# EAGLE design MPB_v1 (EAGLE 6.6.0)
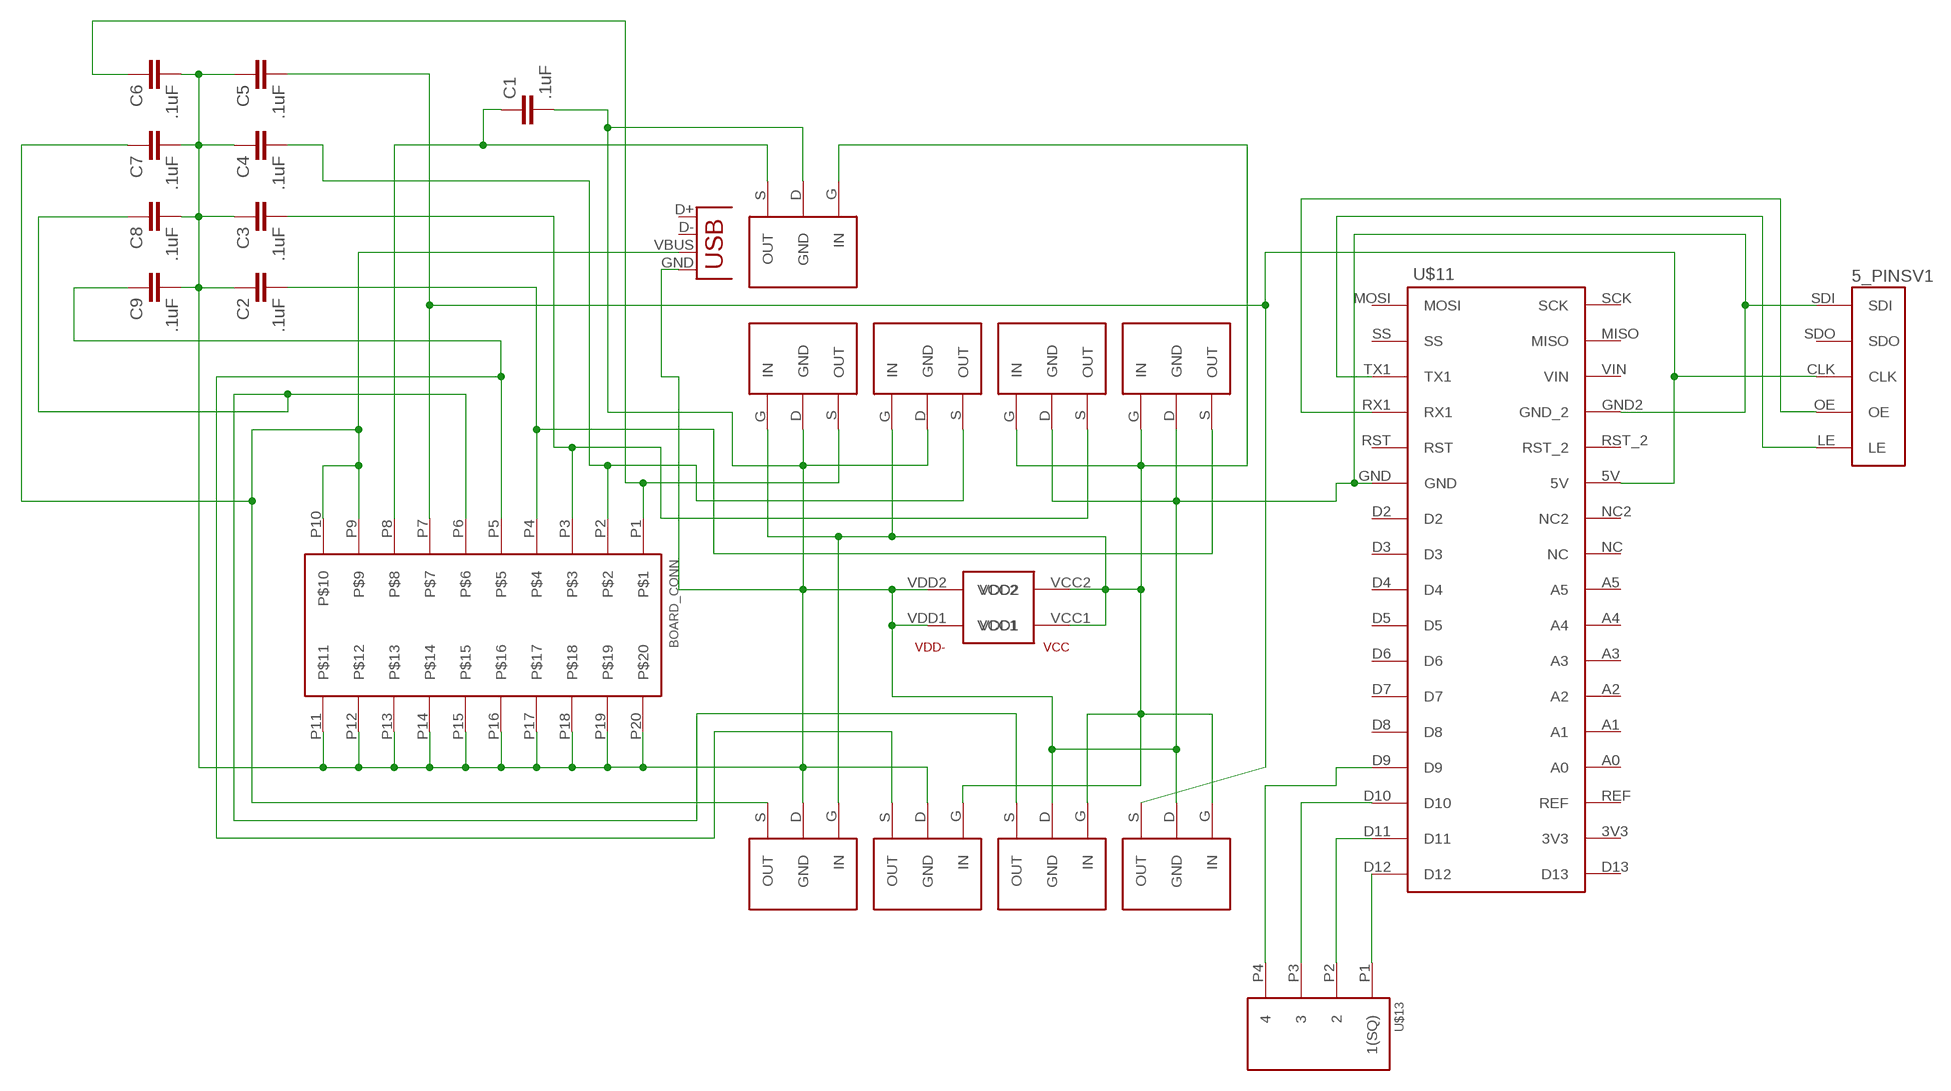
[diagram p0: schematic, sheet 1]

## Parts
_  USB-A-SMD  [USB-A-S-NOSILK-FEMALE]
BOARD_CONN  20PIN_HEADER  [20PIN_3MMHEADER]
C1  .1uF  0.1UF-50V-20%(PTH)KIT-EZ  [CAP-PTH-SMALL-KIT]
C2  .1uF  0.1UF-50V-20%(PTH)KIT-EZ  [CAP-PTH-SMALL-KIT]
C3  .1uF  0.1UF-50V-20%(PTH)KIT-EZ  [CAP-PTH-SMALL-KIT]
C4  .1uF  0.1UF-50V-20%(PTH)KIT-EZ  [CAP-PTH-SMALL-KIT]
C5  .1uF  0.1UF-50V-20%(PTH)KIT-EZ  [CAP-PTH-SMALL-KIT]
C6  .1uF  0.1UF-50V-20%(PTH)KIT-EZ  [CAP-PTH-SMALL-KIT]
C7  .1uF  0.1UF-50V-20%(PTH)KIT-EZ  [CAP-PTH-SMALL-KIT]
C8  .1uF  0.1UF-50V-20%(PTH)KIT-EZ  [CAP-PTH-SMALL-KIT]
C9  .1uF  0.1UF-50V-20%(PTH)KIT-EZ  [CAP-PTH-SMALL-KIT]
PWR  4PIN_POWER  [KPJX-4S]
R1  5VREG  [TO220BH]
R2  5VREG  [TO220BH]
R3  5VREG  [TO220BH]
R4  5VREG  [TO220BH]
R5  5VREG  [TO220BH]
R6  5VREG  [TO220BH]
R7  5VREG  [TO220BH]
R8  5VREG  [TO220BH]
R9  5VREG  [TO220BH]
U$11  ARDUINOMICRO1  [ARDUINOMICRO]
U$12  5_PINSV1  [5PIN_HOLES]
U$13  4_PINS1  [4PIN_HOLES]

## Nets
N$1: PWR.VCC1 PWR.VCC2 R1.G(IN) R2.G(IN) R3.G(IN) R4.G(IN) R5.G(IN) R6.G(IN) R7.G(IN) R8.G(IN) R9.G(IN)
N$2: BOARD_CONN.P1 C6.1 R9.S(OUT)
N$3: BOARD_CONN.P2 C4.2 R1.S(OUT)
N$4: U$11.TX1 U$12.LE
N$5: BOARD_CONN.P3 C3.2 R3.S(OUT)
N$6: BOARD_CONN.P4 C2.2 R2.S(OUT)
N$7: _.GND BOARD_CONN.P11 BOARD_CONN.P12 BOARD_CONN.P13 BOARD_CONN.P14 BOARD_CONN.P15 BOARD_CONN.P16 BOARD_CONN.P17 BOARD_CONN.P18 BOARD_CONN.P19 BOARD_CONN.P20 C1.2 C2.1 C3.1 C4.1 C5.1 C6.2 C7.2 C8.2 C9.2 PWR.VDD1 PWR.VDD2 R1.D(GND) R2.D(GND) R3.D(GND) R4.D(GND) R5.D(GND) R6.D(GND) R7.D(GND) R8.D(GND) R9.D(GND) U$11.GND U$11.GND2(GND_2) U$12.SDI
N$8: _.VBUS BOARD_CONN.P9 BOARD_CONN.P10 C7.1 R5.S(OUT)
N$9: U$11.D12 U$13.P1(1(SQ))
N$10: BOARD_CONN.P5 C9.1 R6.S(OUT)
N$11: BOARD_CONN.P6 C8.1 R8.S(OUT)
N$12: BOARD_CONN.P7 C5.2 R4.S(OUT) U$11.5V U$12.CLK
N$13: U$11.D11 U$13.P2
N$14: U$11.D10 U$13.P3
N$15: U$11.D9 U$13.P4
N$16: U$11.RX1 U$12.OE
N$17: BOARD_CONN.P8 C1.1 R7.S(OUT)
Unconnected: _.D+ _.D- U$11.3V3 U$11.A0 U$11.A1 U$11.A2 U$11.A3 U$11.A4 U$11.A5 U$11.D2 U$11.D3 U$11.D4 U$11.D5 U$11.D6 U$11.D7 U$11.D8 U$11.D13 U$11.MISO U$11.MOSI U$11.NC U$11.NC2 U$11.REF U$11.RST U$11.RST_2 U$11.SCK U$11.SS U$11.VIN U$12.SDO

## Library data of the parts
_ = SparkFun-Connectors:USB: USB Connectors USB-B-PTH is fully proven SKU : PRT-00139/CONN-08278 USB-miniB is fully proven SKU : PRT-00587 USB-A-PCB is untested. USB-A-H is throughly reviewed, but untested. Spark Fun Electronics SKU : PRT-00437 USB-B-SMT is throughly reviewed, but untested. Needs silkscreen touching up. USB-A-S has not been used/tested USB-MB-H has not been used/tested USB-MICROB has been used. CONN-09505; PROD_ID: CONN-09520
BOARD_CONN = ZacksLib:20PIN_HEADER
C1-C9 = SparkFun-Capacitors:0.1UF-50V-20%(PTH): CAP-08370; PROD_ID: CAP-08370
PWR = ZacksLib:4PIN_POWER
R1-R9 = ZacksLib:5VREG
U$11 = ZacksLib:ARDUINOMICRO
U$12 = ZacksLib:5_PINS
U$13 = ZacksLib:4_PINS

## Board
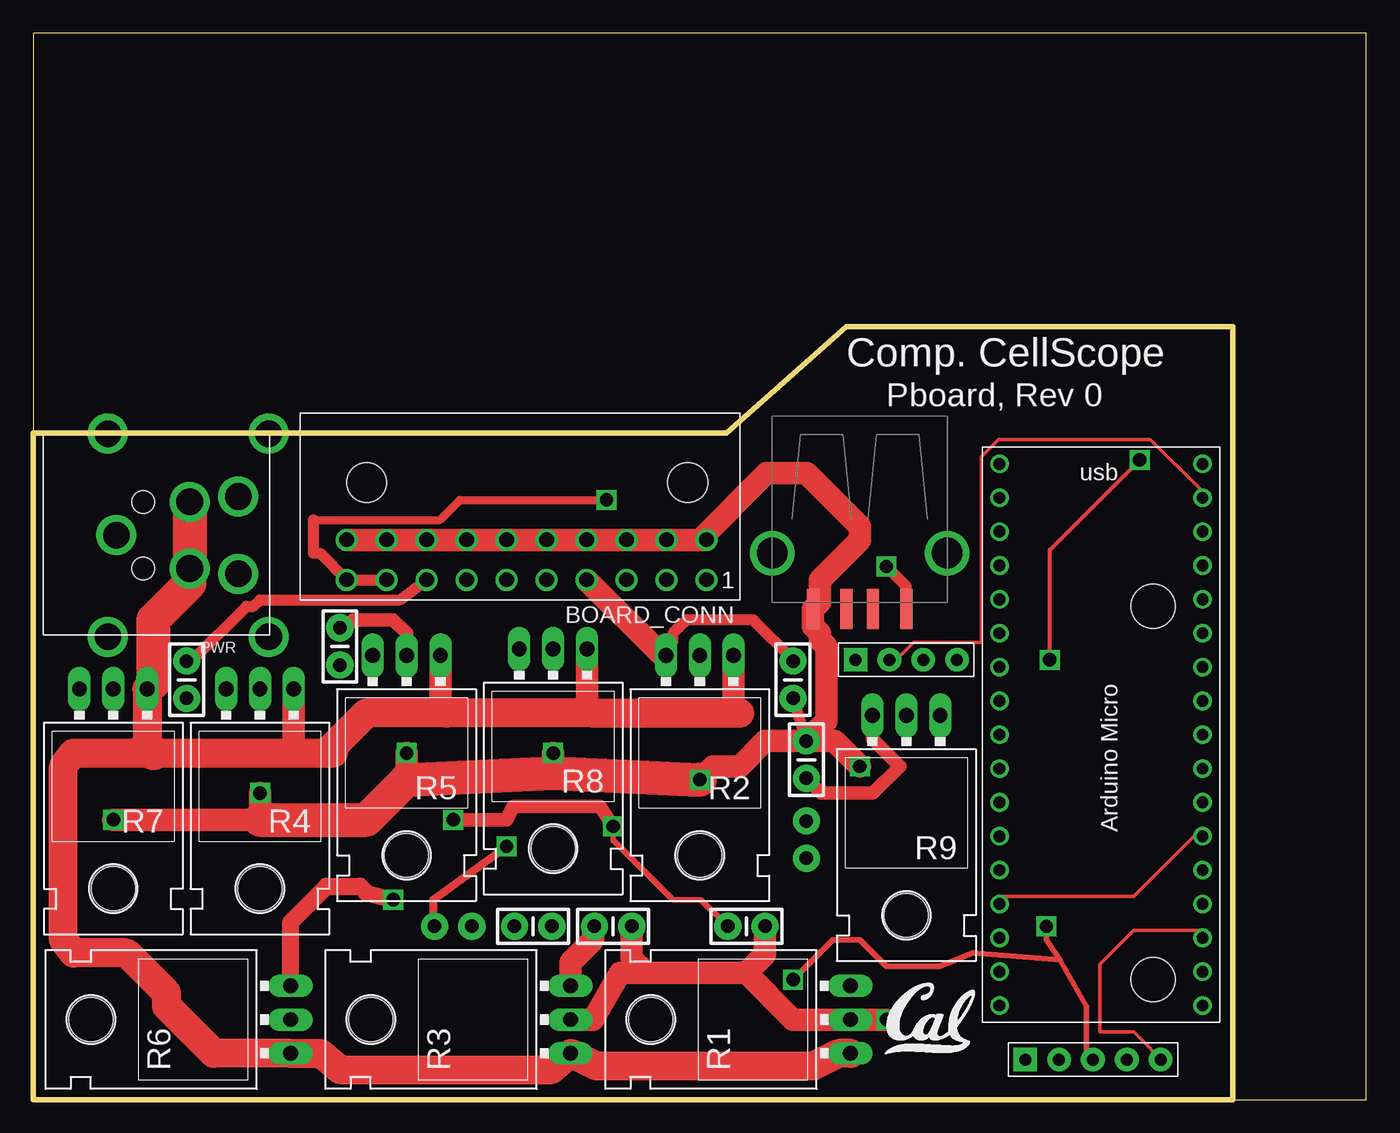
[diagram p1: board, top side]
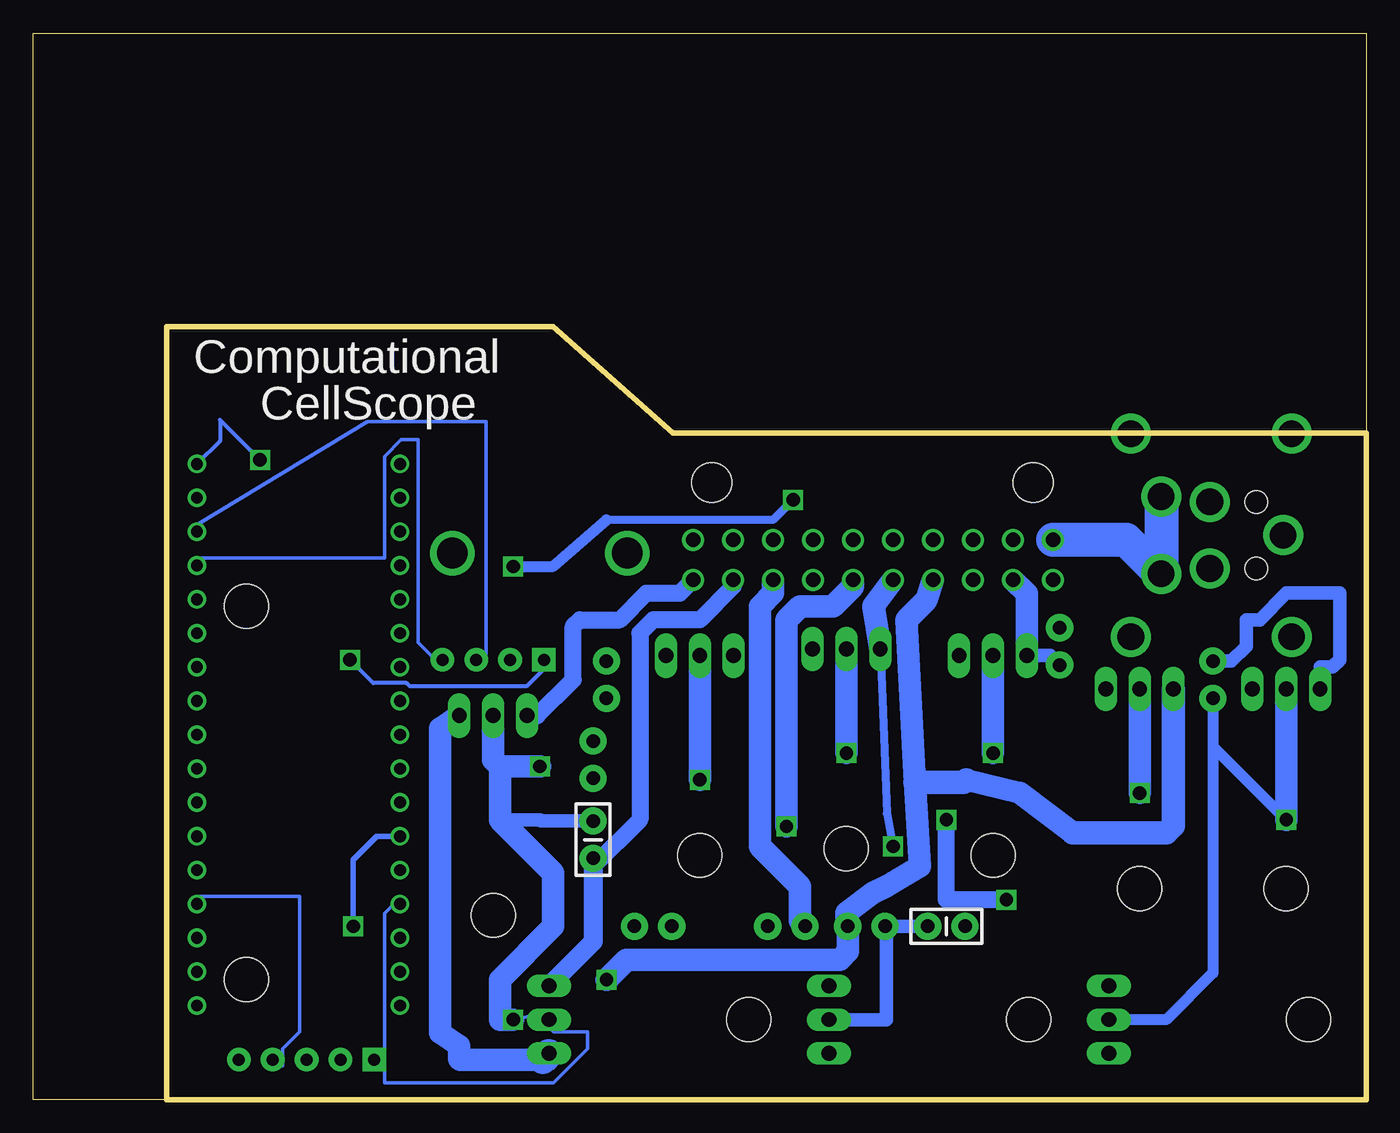
[diagram p2: board, bottom side, seen from below]

Size 100 x 80 mm. Coordinates in mm from the lower left corner, seen from the top.
Outline: 90,0 100,0 100,80 0,80 0,50
Outline: 0,50 52,50 61,58 90,58 90,0
Outline: 90,0 0,0 0,50
Copper layers (1*16): Top 0.035mm / dielectric 1.5mm / Bottom 0.035mm
Design rules "default *": minimum track width 10mil, minimum drill 24mil, track to track 8mil, track to pad 8mil, pad to pad 8mil, via to via 8mil, smd to smd 8mil, copper to edge 40mil, drill to drill 8mil, minimum pad ring 10mil, minimum via ring 8mil, stop-mask expansion 4mil, vias tented up to drill 0mil, thermal gap 10mil
Holes 3.3 mm at 84,9 84,37

### Footprints (pad centres in the part's own frame; a part is rotated, then mirrored left to right if it is on the bottom)
USB-A-S-NOSILK-FEMALE = smd 3 x 0.9: D+ 4.212,-1; D- 4.212,1; GND 4.212,-3.5; VBUS 4.212,3.5 | drill 2.311: S1 0,-6.566; S2 0,6.566
20PIN_3MMHEADER = drill 1.1: P1 -13.5,1.5; P2 -10.5,1.5; P3 -7.5,1.5; P4 -4.5,1.5; P5 -1.5,1.5; P6 1.5,1.5; P7 4.5,1.5; P8 7.5,1.5; P9 10.5,1.5; P10 13.5,1.5; P11 -13.5,-1.5; P12 -10.5,-1.5; P13 -7.5,-1.5; P14 -4.5,-1.5; P15 -1.5,-1.5; P16 1.5,-1.5; P17 4.5,-1.5; P18 7.5,-1.5; P19 10.5,-1.5; P20 13.5,-1.5 | hole 3: 12,-5.8; -12.1,-5.8
CAP-PTH-SMALL-KIT = drill 1.016 pad 2.032: 1 -1.397,0; 2 1.397,0
KPJX-4S = drill 2: SHLD1 7.62,-4.865; SHLD2 -7.62,-4.865; SHLD3 -7.62,-16.93; SHLD4 7.62,-16.93; VCC1 -2.5,-11; VCC2 2.5,-11; VDD1 -2.9,-14.65; VDD2 2.9,-14.65; VDD3 0,-5.5 | hole 1.7: -2.5,-7.5; 2.5,-7.5
TO220BH = drill 1.118 long: D 0,-3.81; G -2.54,-3.81; S 2.54,-3.81 | hole 3.302: 0,11.176
ARDUINOMICRO = drill 0.889: 3V3 16.51,6.35; 5V 16.51,31.75; A0 16.51,11.43; A1 16.51,13.97; A2 16.51,16.51; A3 16.51,19.05; A4 16.51,21.59; A5 16.51,24.13; D2 1.27,29.21; D3 1.27,26.67; D4 1.27,24.13; D5 1.27,21.59; D6 1.27,19.05; D7 1.27,16.51; D8 1.27,13.97; D9 1.27,11.43; D10 1.27,8.89; D11 1.27,6.35; D12 1.27,3.81; D13 16.51,3.81; GND 1.27,31.75; GND2 16.51,36.83; MISO 16.51,41.91; MOSI 1.27,44.45; NC 16.51,26.67; NC2 16.51,29.21; REF 16.51,8.89; RST 1.27,34.29; RST_2 16.51,34.29; RX1 1.27,36.83; SCK 16.51,44.45; SS 1.27,41.91; TX1 1.27,39.37; VIN 16.51,39.37
5PIN_HOLES = drill 0.9 pad 1.778: CLK 0,0; LE 5.08,0; OE 2.54,0; SDO -2.54,0 | drill 0.9 pad 1.778 square: SDI -5.08,0
4PIN_HOLES = drill 0.9 pad 1.778 square: P1 3.81,0 | drill 0.9 pad 1.778: P2 1.27,0; P3 -1.27,0; P4 -3.81,0

### Placement (x,y rotation side)
_  62,41 270 top
BOARD_CONN  37,40.5 180 top
C1  11.5,31.5 270 top
C2  57,31.5 90 top
C3  43.5,13 180 top
C4  58,19.5 270 bottom
C5  37.5,13 0 top
C6  58,25.5 90 top
C7  23,34 90 top
C8  31.5,13 180 bottom
C9  53.5,13 0 top
PWR  0.73,42.34 90 top
R1  57.5,6 90 top
R2  50,29.5 180 top
R3  36.5,6 90 top
R4  17,27 180 top
R5  28,29.5 180 top
R6  15.5,6 90 top
R7  6,27 180 top
R8  39,30 180 top
R9  65.5,25 180 top
U$11  89,51.5 180 top
U$12  79.5,3 0 top
U$13  65.5,33 180 top

### Tracks (layer width: path | path; a pad name or v marks a point on that pad's centre or on a via)
N$1
  Top 1.676: R4.G 19.54,26.46 20,26 | R5.G 30.54,29.46 31,29 | R2.G 52.54,29.46 53,29 | R8.G 41.54,29.46 42,29
  Top 2.184: R1.G 60.46,3.46 58.5,2.5 42.27,2.5 R3.G 38.85,2.25 23,2.25 21.54,3.46 R6.G 13.54,3.46 10,7 10,8 7,11 3,11 2.25,12 2.25,25 3,26 9,26 20,26 22,26 | 22.5,26 22,26 | 8.54,26.46 R7.G 9,31.27 | 53,29 42,29 31,29 25,29 22,26 | PWR.VCC1 11.73,38.73
  Top 2.54: 8.54,26.46 9,26 | 11.73,38.73 9,36 9,31.27 | PWR.VCC2 PWR.VCC1
  Bottom 1.676: 61.77,3 68,3 68.04,3.04 68.04,4.04 69.5,5 69.5,27.85 R9.G
  Bottom 2.184: 61.77,3 R1.G
N$2
  Top 1.016: R9.S 62.96,27.04 65,25 63,23 59.1,23 C6.1
  Bottom 1.27: R9.S 62.19,28.81 59.5,31.5 59.5,35.5 59,36 56,36 54,38 51.5,38 BOARD_CONN.P1
N$3
  Bottom 0.254: C4.2 58.42,17.78 58,17.5
  Bottom 1.27: BOARD_CONN.P2 47.5,38.5 50,36 53.5,36 54.5,35 54.5,21 58,17.5
  Bottom 1.422: C4.2 58,17.5 58,11.85 R1.S
N$4
  Top 0.254: U$11.TX1 87.63,12.7 82.55,12.7 80.01,10.16 80.01,5.08 82.55,5.08 85.09,2.54 U$12.LE
N$5
  Top 1.676: R3.S 40.31,10.31 42,12 42,12.9 C3.2
  Bottom 1.676: C3.2 42.5,13.4 42.5,16 45.5,19 45.5,37 44.5,38 BOARD_CONN.P3
N$6
  Top 0.254: 48.41,35.41 48.26,35.56 48.26,34.29 R2.S
  Top 0.813: C2.2 57.1,32.9 54,36 49,36 48.41,35.41 48,35
  Top 1.676: R2.S 47.19,33.31 BOARD_CONN.P4
N$7  (via drill 1)
  Top 0.254: R1.D 60.96,6.35 60.96,6 | U$11.GND 87.63,20.32 82.55,15.24 72.39,15.24 U$11.GND2
  Top 0.813: C2.1 C6.2
  Top 1.016: C7.2 23.4,35.4 24,36 27,36 28,35 R5.D
  Top 1.676: R3.D 42,6 44,9.5 46,9.5 | 46,9.5 53.5,9.5 | 53.5,9.5 57,6 60.96,6 R1.D v64,6 | v6,21 17,21 v17,23 | v39,26 39,24.5 | v28,26 28,24 | BOARD_CONN.P20 BOARD_CONN.P19 BOARD_CONN.P18 BOARD_CONN.P17 BOARD_CONN.P16 BOARD_CONN.P15 | BOARD_CONN.P15 BOARD_CONN.P14 BOARD_CONN.P13 BOARD_CONN.P12 BOARD_CONN.P11 | BOARD_CONN.P15 50,42 55,47 58,47 62,43 62,42 59,39 59,37.29 _.GND 58.5,35.5 59,35 59,34.5 59.5,34 59.5,28.4 C6.2 | C6.2 54.9,26.9 53,25 51,25 v50,24 | C6.2 60.1,26.9 v62,25 | C9.2 54.9,10.9 53.5,9.5 | C3.1 44.9,10.6 46,9.5
  Top 2.54: 17,21 25,21 28,24 39,24.5 v50,24
  Bottom 0.254: U$11.GND2 72.39,15.24 73.66,13.97 73.66,3.81 U$12.SDI 73.66,2.54 73.66,1.27 60.96,1.27 58.42,3.81 58.42,5.08 60.96,5.08 62.23,6.35 v64,6
  Bottom 0.813: R6.D 15,6 11.5,9.5 C1.2 11.5,26.5 v6,21
  Bottom 1.016: C4.1 61.9,20.9 62,21 65,21 | C8.2 C5.1 36,12.9 36,6 R3.D
  Bottom 1.676: R7.D v6,21 | v50,24 R2.D | R8.D v39,26 | R5.D v28,26 | R4.D v17,23 | v64,6 65,6 65,9 61,13 61,17 65,21 65,25 | 65,25 65.5,25.5 R9.D | v62,25 65,25
  Bottom 2.54: BOARD_CONN.P20 18,42 15.44,39.44 PWR.VDD1 PWR.VDD2
N$8  (via drill 1)
  Top 0.61: 21,43.5 30.5,43.5 32,45 v43,45
  Top 0.813: BOARD_CONN.P9 BOARD_CONN.P10 21.5,41 21,41 21,43.5 | _.VBUS 65.5,38.5 v64,40
  Bottom 0.61: v43,45 44.5,43.5 57,43.5
  Bottom 0.813: v64,40 61,40 57,43.5
  Bottom 1.016: R5.S 23.71,33.31 C7.1
  Bottom 1.676: R5.S 25.46,37.96 BOARD_CONN.P9
N$9  (via drill 1)
  Top 0.305: v76.25,33 76.25,41.25 v83,48
  Bottom 0.305: U$13.P1 61.69,32.31 63,31 71.75,31 72,31.25 74.5,31.25 v76.25,33 | v83,48 86,51 86,49.42 U$11.D12
N$10  (via drill 1)
  Top 0.406: v43.5,20.5 43.5,19.5 48,15 50.1,15 C9.1
  Top 1.016: v31.5,21 35.5,21 36,22 42.5,22 v43.5,20.5
  Top 1.27: R6.S 19.31,13.31 22,16 24.5,16 25,15.5 v27,15
  Bottom 1.27: v27,15 31.5,15 v31.5,21
  Bottom 1.676: v43.5,20.5 43.5,36 42.5,37 40,37 38.5,38.5 BOARD_CONN.P5
N$11  (via drill 1)
  Top 0.61: v35.5,19 30,15 30,13.1
  Top 1.676: 30,13.1 C8.1
  Bottom 0.61: R8.S 35.96,21.46 v35.5,19
  Bottom 1.676: R8.S 36.96,37.04 BOARD_CONN.P6
N$12  (via drill 1)
  Top 0.406: v57,9 60,12 62,12 64,10 68,10 70.5,11 77,10.5 | 77,10.5 79,7 79,3 | v76,13 76,12 77,10.5
  Top 0.813: 79,3 U$12.CLK
  Bottom 0.406: U$11.5V 74.25,19.75 76,18 v76,13
  Bottom 1.676: BOARD_CONN.P7 33,37.5 34.5,36 33.84,23.79 33.5,17.5 36,16 37,15.5 39,14 39,13.1 C5.2 38.9,11.1 39.5,10.5 55.5,10.5 v57,9 | 22,20 26,23 30,24
  Bottom 1.778: R4.S 14.46,20.54 15,20 22,20 | 33.84,23.79 30.21,23.79 30,24
N$13
  Top 0.254: U$11.D11 87.63,45.72 83.82,49.53 72.39,49.53 71.12,48.26 71.12,34.29 66.04,34.29 64.77,33.02 U$13.P2
N$14
  Bottom 0.254: U$11.D10 87.63,43.18 74.93,50.88 66.04,50.88 66.04,33.02 U$13.P3
N$15
  Bottom 0.254: U$11.D9 87.63,40.64 73.66,40.64 73.66,48.26 72.39,49.53 71.12,49.53 71.12,34.29 69.85,33.02 U$13.P4
N$16
  Bottom 0.254: U$11.RX1 87.63,15.24 80.01,15.24 80.01,5.08 81.28,3.81 81.28,2.54 U$12.OE
N$17
  Top 0.813: C1.1 11.9,32.9 16,37 16.5,37 17,37.5 27.5,37.5 BOARD_CONN.P8
  Bottom 1.016: C1.1 10.1,32.9 9,34 9,36 8,36 6,38 2,38 2,33 2.54,32.46 3.46,32.46 R7.S

### Text on the board
tPlace: Comp. CellScope | Pboard, Rev 0
bPlace: Computational | CellScope